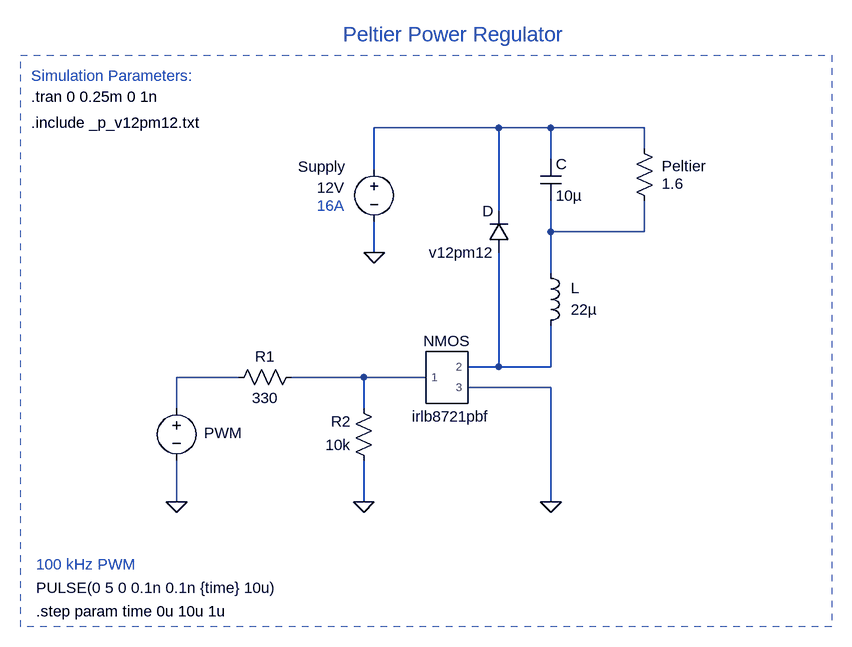
[diagram p0: schematic Peltier Power Regulator.asc]
Peltier Power Regulator.asc, the LTspice schematic file:
Version 4
SHEET 1 1428 820
WIRE 48 48 -144 48
WIRE 128 48 48 48
WIRE 272 48 128 48
WIRE 272 80 272 48
WIRE 128 96 128 48
WIRE -144 112 -144 48
WIRE 48 176 48 48
WIRE 128 208 128 160
WIRE 272 208 272 160
WIRE 272 208 128 208
WIRE -144 240 -144 192
WIRE 128 272 128 208
WIRE 48 416 48 240
WIRE 48 416 0 416
WIRE 128 416 128 352
WIRE 128 416 48 416
WIRE -352 432 -448 432
WIRE -160 432 -272 432
WIRE -64 432 -160 432
WIRE 128 448 0 448
WIRE -448 480 -448 432
WIRE -160 480 -160 432
WIRE -448 624 -448 560
WIRE -160 624 -160 560
WIRE 128 624 128 448
FLAG -448 624 0
FLAG 128 624 0
FLAG -160 624 0
FLAG -144 240 0
SYMBOL ind 112 256 R0
WINDOW 0 47 39 Left 2
WINDOW 3 47 72 Left 2
SYMATTR InstName L
SYMATTR Value 22µ
SYMATTR SpiceLine Ipk=12 Rser=26.5m
SYMBOL voltage -448 464 R0
WINDOW 3 -216 292 Left 2
WINDOW 123 0 0 Left 0
WINDOW 39 0 0 Left 0
WINDOW 0 42 54 Left 2
SYMATTR Value PULSE(0 5 0 0.1n 0.1n {time} 10u)
SYMATTR InstName PWM
SYMBOL voltage -144 96 R0
WINDOW 123 0 0 Left 0
WINDOW 39 0 0 Left 0
WINDOW 0 -117 12 Left 2
WINDOW 3 -88 44 Left 2
SYMATTR InstName Supply
SYMATTR Value 12V
SYMBOL AutoGenerated\\irlb8721pbf -32 432 R0
WINDOW 3 6 45 Top 2
SYMATTR InstName NMOS
SYMBOL res 256 64 R0
WINDOW 0 43 43 Left 2
WINDOW 3 43 70 Left 2
SYMATTR InstName Peltier
SYMATTR Value 1.6
SYMBOL res -256 416 R90
WINDOW 0 0 56 VBottom 2
WINDOW 3 32 56 VTop 2
SYMATTR InstName R1
SYMATTR Value 330
SYMBOL diode 64 240 R180
WINDOW 0 24 64 Left 2
WINDOW 3 24 0 Left 2
SYMATTR InstName D
SYMATTR Value v12pm12
SYMBOL cap 112 96 R0
SYMATTR InstName C
SYMATTR Value 10µ
SYMATTR SpiceLine V=35 Irms=0 Rser=0 Lser=0
SYMBOL res -144 576 R180
WINDOW 0 36 76 Left 2
WINDOW 3 36 40 Left 2
SYMATTR InstName R2
SYMATTR Value 10k
TEXT -672 0 Left 2 !.tran 0 0.25m 0 1n
TEXT -664 792 Left 2 !.step param time 0u 10u 1u
TEXT -664 720 Left 2 ;100 kHz PWM
TEXT -192 -96 Left 3 ;Peltier Power Regulator
TEXT -232 168 Left 2 ;16A
TEXT -672 -32 Left 2 ;Simulation Parameters:
TEXT -672 40 Left 2 !.include _p_v12pm12.txt
RECTANGLE Normal 560 816 -688 -64 2

The netlist it stands for:
* Peltier Power Regulator.asc
L N002 N003 22µ Ipk=12 Rser=26.5m
V§PWM N004 0 PULSE(0 5 0 0.1n 0.1n {time} 10u)
V§Supply N001 0 12V
XNMOS N005 N003 0 irlb8721pbf  ; pins 1 2 3
R§Peltier N001 N002 1.6
R1 N005 N004 330
D N003 N001 v12pm12
C N001 N002 10µ V=35 Irms=0 Rser=0 Lser=0
R2 0 N005 10k
.model D D
.lib standard.dio
.tran 0 0.25m 0 1n
.step param time 0u 10u 1u
* 100 kHz PWM
* Peltier Power Regulator
* 16A
* Simulation Parameters:
.include _p_v12pm12.txt
.lib C:\Program Files\LTC\LTspiceXVII\lib\sub\Infineon-IRLB8721PBF-SimulationModels-v01_00-EN.spi
.backanno
.end